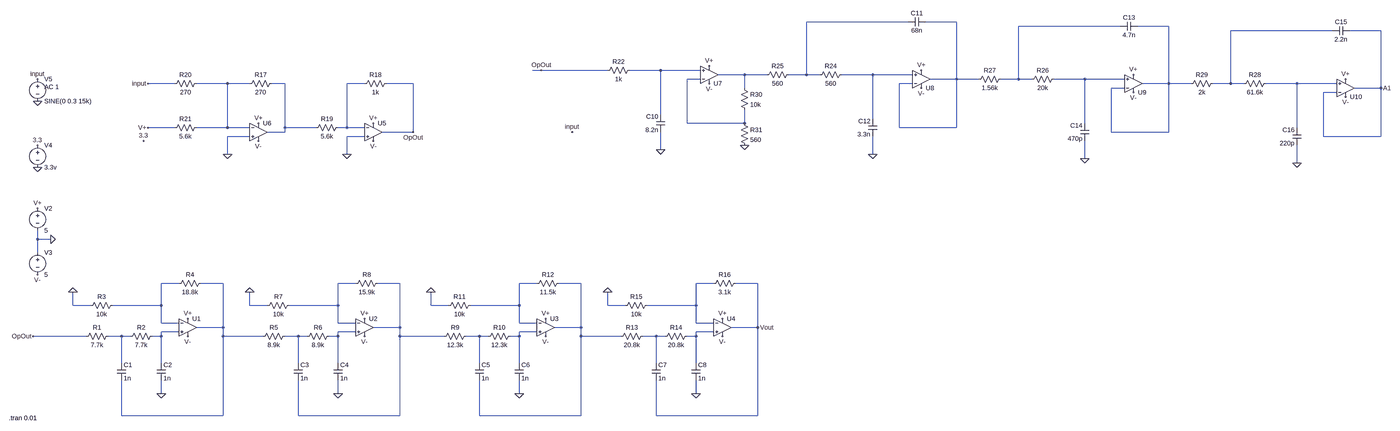
[diagram p0: schematic PreProcessingCircuits.asc, whole sheet]
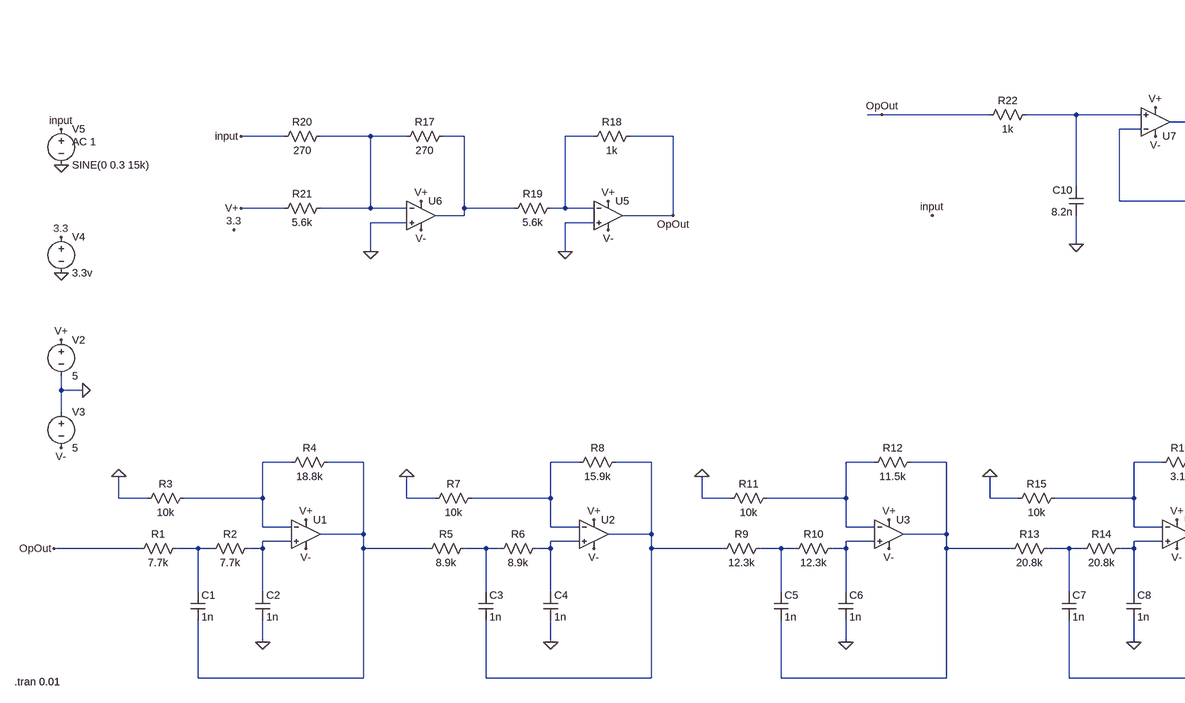
[diagram p1: schematic PreProcessingCircuits.asc, part, row 1 of 1, column 1 of 2]
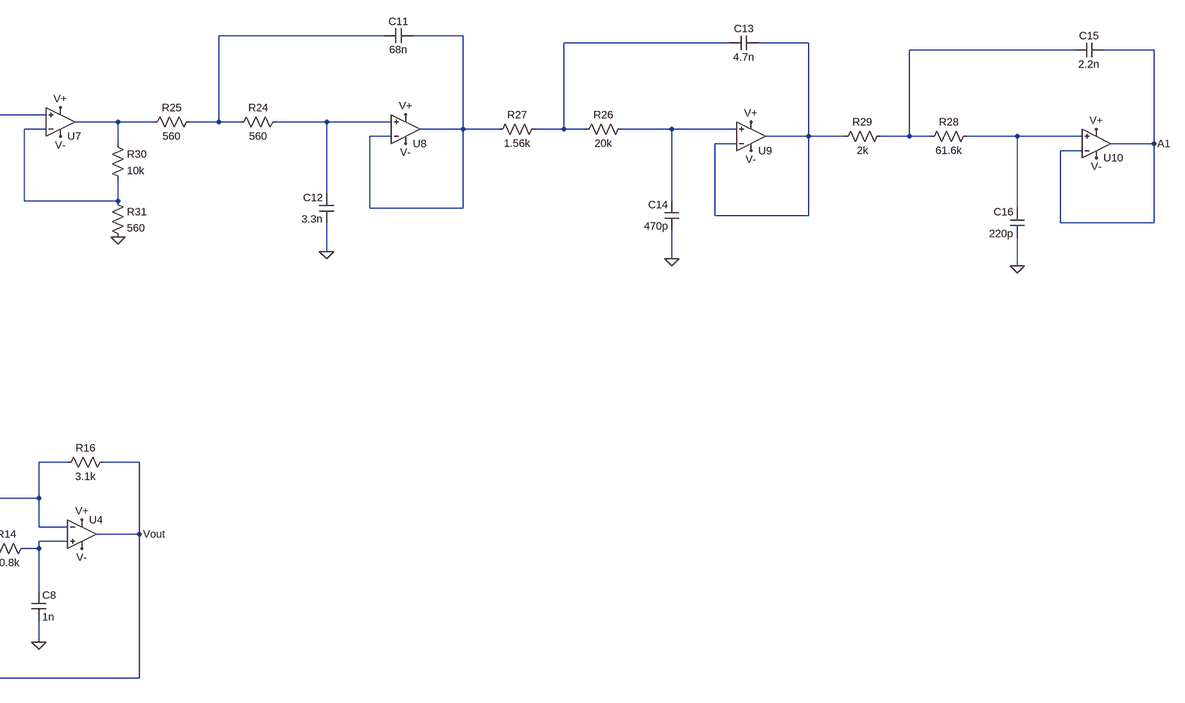
[diagram p2: schematic PreProcessingCircuits.asc, part, row 1 of 1, column 2 of 2]
PreProcessingCircuits.asc, the LTspice schematic file:
Version 4
SHEET 1 4560 680
WIRE 2816 -992 2448 -992
WIRE 2992 -992 2880 -992
WIRE 3584 -976 3216 -976
WIRE 3760 -976 3648 -976
WIRE 4352 -960 3984 -960
WIRE 4528 -960 4416 -960
WIRE 1488 -816 1456 -816
WIRE 1728 -816 1488 -816
WIRE 1920 -816 1808 -816
WIRE 2064 -816 1920 -816
WIRE 2224 -800 2128 -800
WIRE 2304 -800 2224 -800
WIRE 2448 -800 2448 -992
WIRE 2448 -800 2384 -800
WIRE 2496 -800 2448 -800
WIRE 2688 -800 2576 -800
WIRE 2832 -800 2688 -800
WIRE 2064 -784 2016 -784
WIRE 2992 -784 2992 -992
WIRE 2992 -784 2896 -784
WIRE 3072 -784 2992 -784
WIRE 3216 -784 3216 -976
WIRE 3216 -784 3152 -784
WIRE 3264 -784 3216 -784
WIRE 3456 -784 3344 -784
WIRE 3600 -784 3456 -784
WIRE 160 -768 64 -768
WIRE 352 -768 240 -768
WIRE 432 -768 352 -768
WIRE 560 -768 512 -768
WIRE 848 -768 784 -768
WIRE 1024 -768 928 -768
WIRE 2832 -768 2784 -768
WIRE 3760 -768 3760 -976
WIRE 3760 -768 3664 -768
WIRE 3840 -768 3760 -768
WIRE 3984 -768 3984 -960
WIRE 3984 -768 3920 -768
WIRE 4032 -768 3984 -768
WIRE 4224 -768 4112 -768
WIRE 4368 -768 4224 -768
WIRE 2224 -752 2224 -800
WIRE 3600 -752 3552 -752
WIRE 4528 -752 4528 -960
WIRE 4528 -752 4432 -752
WIRE 4368 -736 4320 -736
WIRE 1920 -656 1920 -816
WIRE 2688 -640 2688 -800
WIRE 2016 -624 2016 -784
WIRE 2224 -624 2224 -672
WIRE 2224 -624 2016 -624
WIRE 3456 -624 3456 -784
WIRE 160 -608 64 -608
WIRE 352 -608 352 -768
WIRE 352 -608 240 -608
WIRE 432 -608 352 -608
WIRE 560 -608 560 -768
WIRE 672 -608 560 -608
WIRE 784 -608 784 -768
WIRE 784 -608 752 -608
WIRE 848 -608 784 -608
WIRE 2784 -608 2784 -768
WIRE 2992 -608 2992 -784
WIRE 2992 -608 2784 -608
WIRE 4224 -608 4224 -768
WIRE 560 -592 560 -608
WIRE 560 -592 496 -592
WIRE 1024 -592 1024 -768
WIRE 1024 -592 912 -592
WIRE 3552 -592 3552 -752
WIRE 3760 -592 3760 -768
WIRE 3760 -592 3552 -592
WIRE 432 -576 352 -576
WIRE 848 -576 784 -576
WIRE 4320 -576 4320 -736
WIRE 4528 -576 4528 -752
WIRE 4528 -576 4320 -576
WIRE 1920 -528 1920 -592
WIRE 352 -512 352 -576
WIRE 784 -512 784 -576
WIRE 2688 -512 2688 -576
WIRE 3456 -496 3456 -560
WIRE 4224 -480 4224 -544
WIRE -336 -160 -336 -192
WIRE -288 -160 -336 -160
WIRE -336 -112 -336 -160
WIRE 176 0 112 0
WIRE 336 0 256 0
WIRE 816 0 752 0
WIRE 976 0 896 0
WIRE 1472 0 1408 0
WIRE 1632 0 1552 0
WIRE 2112 0 2048 0
WIRE 2272 0 2192 0
WIRE -208 80 -208 32
WIRE -144 80 -208 80
WIRE 112 80 112 0
WIRE 112 80 -64 80
WIRE 432 80 432 32
WIRE 496 80 432 80
WIRE 752 80 752 0
WIRE 752 80 576 80
WIRE 1088 80 1088 32
WIRE 1152 80 1088 80
WIRE 1408 80 1408 0
WIRE 1408 80 1232 80
WIRE 1728 80 1728 32
WIRE 1792 80 1728 80
WIRE 2048 80 2048 0
WIRE 2048 80 1872 80
WIRE 112 144 112 80
WIRE 176 144 112 144
WIRE 752 144 752 80
WIRE 816 144 752 144
WIRE 1408 144 1408 80
WIRE 1472 144 1408 144
WIRE 2048 144 2048 80
WIRE 2112 144 2048 144
WIRE 336 160 336 0
WIRE 336 160 240 160
WIRE 976 160 976 0
WIRE 976 160 880 160
WIRE 1632 160 1632 0
WIRE 1632 160 1536 160
WIRE 2272 160 2272 0
WIRE 2272 160 2176 160
WIRE 176 176 112 176
WIRE 816 176 752 176
WIRE 1472 176 1408 176
WIRE 2112 176 2048 176
WIRE -160 192 -352 192
WIRE -32 192 -80 192
WIRE 0 192 -32 192
WIRE 112 192 112 176
WIRE 112 192 80 192
WIRE 336 192 336 160
WIRE 480 192 336 192
WIRE 608 192 560 192
WIRE 640 192 608 192
WIRE 752 192 752 176
WIRE 752 192 720 192
WIRE 976 192 976 160
WIRE 1136 192 976 192
WIRE 1264 192 1216 192
WIRE 1296 192 1264 192
WIRE 1408 192 1408 176
WIRE 1408 192 1376 192
WIRE 1632 192 1632 160
WIRE 1776 192 1632 192
WIRE 1904 192 1856 192
WIRE 1936 192 1904 192
WIRE 2048 192 2048 176
WIRE 2048 192 2016 192
WIRE -32 288 -32 192
WIRE 112 288 112 192
WIRE 608 288 608 192
WIRE 752 288 752 192
WIRE 1264 288 1264 192
WIRE 1408 288 1408 192
WIRE 1904 288 1904 192
WIRE 2048 288 2048 192
WIRE 112 400 112 352
WIRE 752 400 752 352
WIRE 1408 400 1408 352
WIRE 2048 400 2048 352
WIRE -32 480 -32 352
WIRE 336 480 336 192
WIRE 336 480 -32 480
WIRE 608 480 608 352
WIRE 976 480 976 192
WIRE 976 480 608 480
WIRE 1264 480 1264 352
WIRE 1632 480 1632 192
WIRE 1632 480 1264 480
WIRE 1904 480 1904 352
WIRE 2272 480 2272 160
WIRE 2272 480 1904 480
FLAG -288 -160 0
FLAG -208 32 0
FLAG 112 400 0
FLAG -336 -272 V+
FLAG -336 -32 V-
FLAG 208 128 V+
FLAG 208 192 V-
FLAG 432 32 0
FLAG 752 400 0
FLAG 848 128 V+
FLAG 848 192 V-
FLAG 1088 32 0
FLAG 1408 400 0
FLAG 1504 128 V+
FLAG 1504 192 V-
FLAG 1728 32 0
FLAG 2048 400 0
FLAG 2144 128 V+
FLAG 2144 192 V-
FLAG 2272 160 Vout
FLAG 464 -624 V+
FLAG 880 -624 V+
FLAG 464 -560 V-
FLAG 880 -560 V-
FLAG 784 -512 0
FLAG 352 -512 0
FLAG -336 -544 3.3
FLAG 48 -560 3.3
FLAG -336 -704 0
FLAG -336 -464 0
FLAG -336 -784 input
FLAG 1024 -592 OpOut
FLAG 64 -768 input
FLAG -352 192 OpOut
FLAG 2096 -832 V+
FLAG 2096 -768 V-
FLAG 1920 -528 0
FLAG 2864 -816 V+
FLAG 2864 -752 V-
FLAG 2688 -512 0
FLAG 3632 -800 V+
FLAG 3632 -736 V-
FLAG 3456 -496 0
FLAG 4400 -784 V+
FLAG 4400 -720 V-
FLAG 4224 -480 0
FLAG 2224 -544 0
FLAG 1600 -592 input
FLAG 1488 -816 OpOut
FLAG 4528 -752 A1
FLAG 64 -608 V+
SYMBOL OpAmps\\UniversalOpamp2 208 160 R0
SYMATTR InstName U1
SYMBOL res -64 176 R90
WINDOW 0 0 56 VBottom 2
WINDOW 3 32 56 VTop 2
SYMATTR InstName R1
SYMATTR Value 7.7k
SYMBOL res 96 176 R90
WINDOW 0 0 56 VBottom 2
WINDOW 3 32 56 VTop 2
SYMATTR InstName R2
SYMATTR Value 7.7k
SYMBOL res -48 64 R90
WINDOW 0 0 56 VBottom 2
WINDOW 3 32 56 VTop 2
SYMATTR InstName R3
SYMATTR Value 10k
SYMBOL res 272 -16 R90
WINDOW 0 0 56 VBottom 2
WINDOW 3 32 56 VTop 2
SYMATTR InstName R4
SYMATTR Value 18.8k
SYMBOL cap -48 288 R0
SYMATTR InstName C1
SYMATTR Value 1n
SYMBOL cap 96 288 R0
SYMATTR InstName C2
SYMATTR Value 1n
SYMBOL voltage -336 -288 R0
WINDOW 123 0 0 Left 0
WINDOW 39 0 0 Left 0
SYMATTR InstName V2
SYMATTR Value 5
SYMBOL voltage -336 -128 R0
WINDOW 123 0 0 Left 0
WINDOW 39 0 0 Left 0
SYMATTR InstName V3
SYMATTR Value 5
SYMBOL OpAmps\\UniversalOpamp2 848 160 R0
SYMATTR InstName U2
SYMBOL res 576 176 R90
WINDOW 0 0 56 VBottom 2
WINDOW 3 32 56 VTop 2
SYMATTR InstName R5
SYMATTR Value 8.9k
SYMBOL res 736 176 R90
WINDOW 0 0 56 VBottom 2
WINDOW 3 32 56 VTop 2
SYMATTR InstName R6
SYMATTR Value 8.9k
SYMBOL res 592 64 R90
WINDOW 0 0 56 VBottom 2
WINDOW 3 32 56 VTop 2
SYMATTR InstName R7
SYMATTR Value 10k
SYMBOL res 912 -16 R90
WINDOW 0 0 56 VBottom 2
WINDOW 3 32 56 VTop 2
SYMATTR InstName R8
SYMATTR Value 15.9k
SYMBOL cap 592 288 R0
SYMATTR InstName C3
SYMATTR Value 1n
SYMBOL cap 736 288 R0
SYMATTR InstName C4
SYMATTR Value 1n
SYMBOL OpAmps\\UniversalOpamp2 1504 160 R0
SYMATTR InstName U3
SYMBOL res 1232 176 R90
WINDOW 0 0 56 VBottom 2
WINDOW 3 32 56 VTop 2
SYMATTR InstName R9
SYMATTR Value 12.3k
SYMBOL res 1392 176 R90
WINDOW 0 0 56 VBottom 2
WINDOW 3 32 56 VTop 2
SYMATTR InstName R10
SYMATTR Value 12.3k
SYMBOL res 1248 64 R90
WINDOW 0 0 56 VBottom 2
WINDOW 3 32 56 VTop 2
SYMATTR InstName R11
SYMATTR Value 10k
SYMBOL res 1568 -16 R90
WINDOW 0 0 56 VBottom 2
WINDOW 3 32 56 VTop 2
SYMATTR InstName R12
SYMATTR Value 11.5k
SYMBOL cap 1248 288 R0
SYMATTR InstName C5
SYMATTR Value 1n
SYMBOL cap 1392 288 R0
SYMATTR InstName C6
SYMATTR Value 1n
SYMBOL OpAmps\\UniversalOpamp2 2144 160 R0
SYMATTR InstName U4
SYMBOL res 1872 176 R90
WINDOW 0 0 56 VBottom 2
WINDOW 3 32 56 VTop 2
SYMATTR InstName R13
SYMATTR Value 20.8k
SYMBOL res 2032 176 R90
WINDOW 0 0 56 VBottom 2
WINDOW 3 32 56 VTop 2
SYMATTR InstName R14
SYMATTR Value 20.8k
SYMBOL res 1888 64 R90
WINDOW 0 0 56 VBottom 2
WINDOW 3 32 56 VTop 2
SYMATTR InstName R15
SYMATTR Value 10k
SYMBOL res 2208 -16 R90
WINDOW 0 0 56 VBottom 2
WINDOW 3 32 56 VTop 2
SYMATTR InstName R16
SYMATTR Value 3.1k
SYMBOL cap 1888 288 R0
SYMATTR InstName C7
SYMATTR Value 1n
SYMBOL cap 2032 288 R0
SYMATTR InstName C8
SYMATTR Value 1n
SYMBOL OpAmps\\UniversalOpamp2 880 -592 R0
SYMATTR InstName U5
SYMBOL res 528 -784 R90
WINDOW 0 0 56 VBottom 2
WINDOW 3 32 56 VTop 2
SYMATTR InstName R17
SYMATTR Value 270
SYMBOL res 944 -784 R90
WINDOW 0 0 56 VBottom 2
WINDOW 3 32 56 VTop 2
SYMATTR InstName R18
SYMATTR Value 1k
SYMBOL res 768 -624 R90
WINDOW 0 0 56 VBottom 2
WINDOW 3 32 56 VTop 2
SYMATTR InstName R19
SYMATTR Value 5.6k
SYMBOL res 256 -784 R90
WINDOW 0 0 56 VBottom 2
WINDOW 3 32 56 VTop 2
SYMATTR InstName R20
SYMATTR Value 270
SYMBOL res 256 -624 R90
WINDOW 0 0 56 VBottom 2
WINDOW 3 32 56 VTop 2
SYMATTR InstName R21
SYMATTR Value 5.6k
SYMBOL voltage -336 -560 R0
SYMATTR InstName V4
SYMATTR Value 3.3v
SYMBOL voltage -336 -800 R0
WINDOW 123 24 44 Left 2
WINDOW 39 0 0 Left 0
SYMATTR Value2 AC 1
SYMATTR InstName V5
SYMATTR Value SINE(0 0.3 15k)
SYMBOL OpAmps\\UniversalOpamp2 2096 -800 M180
SYMATTR InstName U7
SYMBOL cap 1936 -592 R180
WINDOW 0 24 56 Left 2
WINDOW 3 24 8 Left 2
SYMATTR InstName C10
SYMATTR Value 8.2n
SYMBOL res 1824 -832 R90
WINDOW 0 0 56 VBottom 2
WINDOW 3 32 56 VTop 2
SYMATTR InstName R22
SYMATTR Value 1k
SYMBOL OpAmps\\UniversalOpamp2 2864 -784 M180
SYMATTR InstName U8
SYMBOL cap 2880 -1008 R90
WINDOW 0 0 32 VBottom 2
WINDOW 3 32 32 VTop 2
SYMATTR InstName C11
SYMATTR Value 68n
SYMBOL cap 2704 -576 R180
WINDOW 0 24 56 Left 2
WINDOW 3 24 8 Left 2
SYMATTR InstName C12
SYMATTR Value 3.3n
SYMBOL res 2592 -816 R90
WINDOW 0 0 56 VBottom 2
WINDOW 3 32 56 VTop 2
SYMATTR InstName R24
SYMATTR Value 560
SYMBOL res 2400 -816 R90
WINDOW 0 0 56 VBottom 2
WINDOW 3 32 56 VTop 2
SYMATTR InstName R25
SYMATTR Value 560
SYMBOL OpAmps\\UniversalOpamp2 3632 -768 M180
SYMATTR InstName U9
SYMBOL cap 3648 -992 R90
WINDOW 0 0 32 VBottom 2
WINDOW 3 32 32 VTop 2
SYMATTR InstName C13
SYMATTR Value 4.7n
SYMBOL cap 3472 -560 R180
WINDOW 0 24 56 Left 2
WINDOW 3 24 8 Left 2
SYMATTR InstName C14
SYMATTR Value 470p
SYMBOL res 3360 -800 R90
WINDOW 0 0 56 VBottom 2
WINDOW 3 32 56 VTop 2
SYMATTR InstName R26
SYMATTR Value 20k
SYMBOL res 3168 -800 R90
WINDOW 0 0 56 VBottom 2
WINDOW 3 32 56 VTop 2
SYMATTR InstName R27
SYMATTR Value 1.56k
SYMBOL OpAmps\\UniversalOpamp2 4400 -752 M180
SYMATTR InstName U10
SYMBOL cap 4416 -976 R90
WINDOW 0 0 32 VBottom 2
WINDOW 3 32 32 VTop 2
SYMATTR InstName C15
SYMATTR Value 2.2n
SYMBOL cap 4240 -544 R180
WINDOW 0 24 56 Left 2
WINDOW 3 24 8 Left 2
SYMATTR InstName C16
SYMATTR Value 220p
SYMBOL res 4128 -784 R90
WINDOW 0 0 56 VBottom 2
WINDOW 3 32 56 VTop 2
SYMATTR InstName R28
SYMATTR Value 61.6k
SYMBOL res 3936 -784 R90
WINDOW 0 0 56 VBottom 2
WINDOW 3 32 56 VTop 2
SYMATTR InstName R29
SYMATTR Value 2k
SYMBOL res 2208 -768 R0
SYMATTR InstName R30
SYMATTR Value 10k
SYMBOL res 2208 -640 R0
SYMATTR InstName R31
SYMATTR Value 560
SYMBOL OpAmps\\UniversalOpamp2 464 -592 R0
SYMATTR InstName U6
TEXT -440 488 Left 2 !.tran 0.01

The netlist it stands for:
* PreProcessingCircuits.asc
XU1 N022 N015 V+ V- N016 level.2 Avol=1Meg GBW=10Meg Slew=10Meg ilimit=25m rail=0 Vos=0 phimargin=45 en=0 enk=0 in=0 ink=0 Rin=500Meg  ; pins IN+ IN- V+ V- OUT
R1 N026 OpOut 7.7k
R2 N022 N026 7.7k
R3 N015 0 10k
R4 N016 N015 18.8k
C1 N026 N016 1n
C2 N022 0 1n
V2 V+ 0 5
V3 0 V- 5
XU2 N023 N017 V+ V- N018 level.2 Avol=1Meg GBW=10Meg Slew=10Meg ilimit=25m rail=0 Vos=0 phimargin=45 en=0 enk=0 in=0 ink=0 Rin=500Meg  ; pins IN+ IN- V+ V- OUT
R5 N027 N016 8.9k
R6 N023 N027 8.9k
R7 N017 0 10k
R8 N018 N017 15.9k
C3 N027 N018 1n
C4 N023 0 1n
XU3 N024 N019 V+ V- N020 level.2 Avol=1Meg GBW=10Meg Slew=10Meg ilimit=25m rail=0 Vos=0 phimargin=45 en=0 enk=0 in=0 ink=0 Rin=500Meg  ; pins IN+ IN- V+ V- OUT
R9 N028 N018 12.3k
R10 N024 N028 12.3k
R11 N019 0 10k
R12 N020 N019 11.5k
C5 N028 N020 1n
C6 N024 0 1n
XU4 N025 N021 V+ V- Vout level.2 Avol=1Meg GBW=10Meg Slew=10Meg ilimit=25m rail=0 Vos=0 phimargin=45 en=0 enk=0 in=0 ink=0 Rin=500Meg  ; pins IN+ IN- V+ V- OUT
R13 N029 N020 20.8k
R14 N025 N029 20.8k
R15 N021 0 10k
R16 Vout N021 3.1k
C7 N029 Vout 1n
C8 N025 0 1n
XU5 0 N013 V+ V- OpOut level.2 Avol=1Meg GBW=10Meg Slew=10Meg ilimit=25m rail=0 Vos=0 phimargin=45 en=0 enk=0 in=0 ink=0 Rin=500Meg  ; pins IN+ IN- V+ V- OUT
R17 N012 N011 270
R18 OpOut N013 1k
R19 N013 N012 5.6k
R20 N011 input 270
R21 N011 V+ 5.6k
V4 3.3 0 3.3v
V5 input 0 SINE(0 0.3 15k) AC 1
XU7 N006 N009 V- V+ N007 level.2 Avol=1Meg GBW=10Meg Slew=10Meg ilimit=25m rail=0 Vos=0 phimargin=45 en=0 enk=0 in=0 ink=0 Rin=500Meg  ; pins IN+ IN- V+ V- OUT
C10 0 N006 8.2n
R22 N006 OpOut 1k
XU8 N008 N002 V- V+ N002 level.2 Avol=1Meg GBW=10Meg Slew=10Meg ilimit=25m rail=0 Vos=0 phimargin=45 en=0 enk=0 in=0 ink=0 Rin=500Meg  ; pins IN+ IN- V+ V- OUT
C11 N002 N001 68n
C12 0 N008 3.3n
R24 N008 N001 560
R25 N001 N007 560
XU9 N010 N004 V- V+ N004 level.2 Avol=1Meg GBW=10Meg Slew=10Meg ilimit=25m rail=0 Vos=0 phimargin=45 en=0 enk=0 in=0 ink=0 Rin=500Meg  ; pins IN+ IN- V+ V- OUT
C13 N004 N003 4.7n
C14 0 N010 470p
R26 N010 N003 20k
R27 N003 N002 1.56k
XU10 N014 A1 V- V+ A1 level.2 Avol=1Meg GBW=10Meg Slew=10Meg ilimit=25m rail=0 Vos=0 phimargin=45 en=0 enk=0 in=0 ink=0 Rin=500Meg  ; pins IN+ IN- V+ V- OUT
C15 A1 N005 2.2n
C16 0 N014 220p
R28 N014 N005 61.6k
R29 N005 N004 2k
R30 N007 N009 10k
R31 N009 0 560
XU6 0 N011 V+ V- N012 level.2 Avol=1Meg GBW=10Meg Slew=10Meg ilimit=25m rail=0 Vos=0 phimargin=45 en=0 enk=0 in=0 ink=0 Rin=500Meg  ; pins IN+ IN- V+ V- OUT
.tran 0.01
.lib UniversalOpamps2.sub
.backanno
.end